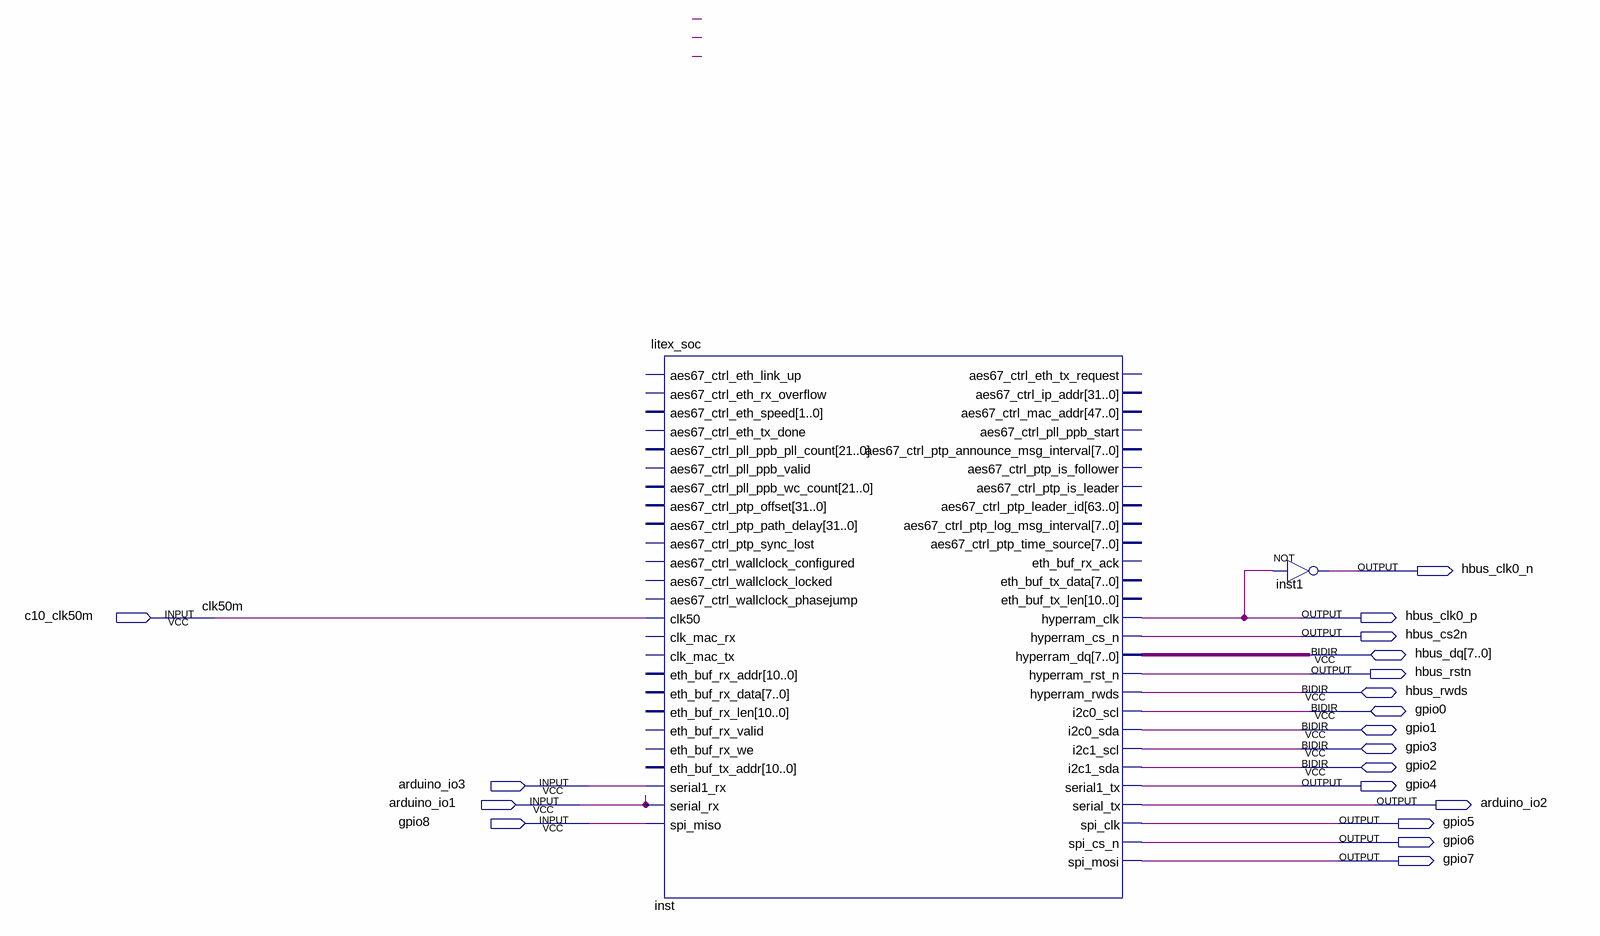
[diagram p0: schematic sheet]
// Quartus schematic soc_top.bdf as structural Verilog: 2 symbols, 19 pins
module soc_top (
  input  c10_clk50m,
  input  arduino_io3,
  input  arduino_io1,
  input  gpio8,
  inout  [7:0] hbus_dq,
  inout  hbus_rwds,
  inout  gpio0,
  inout  gpio1,
  inout  gpio3,
  inout  gpio2,
  output hbus_clk0_n,
  output hbus_clk0_p,
  output hbus_cs2n,
  output hbus_rstn,
  output gpio4,
  output arduino_io2,
  output gpio5,
  output gpio6,
  output gpio7
);

  litex_soc inst (
    .clk50(c10_clk50m), .serial1_rx(arduino_io3), .serial_rx(arduino_io1), .spi_miso(gpio8),
    .hyperram_clk(hbus_clk0_p), .hyperram_cs_n(hbus_cs2n), .hyperram_rst_n(hbus_rstn), .serial1_tx(gpio4),
    .serial_tx(arduino_io2), .spi_clk(gpio5), .spi_cs_n(gpio6), .spi_mosi(gpio7), .hyperram_dq(hbus_dq),
    .hyperram_rwds(hbus_rwds), .i2c0_scl(gpio0), .i2c0_sda(gpio1), .i2c1_scl(gpio3), .i2c1_sda(gpio2));  // open: aes67_ctrl_eth_link_up, aes67_ctrl_eth_rx_overflow, aes67_ctrl_eth_speed, aes67_ctrl_eth_tx_done, aes67_ctrl_pll_ppb_pll_count, aes67_ctrl_pll_ppb_valid, aes67_ctrl_pll_ppb_wc_count, aes67_ctrl_ptp_offset, aes67_ctrl_ptp_path_delay, aes67_ctrl_ptp_sync_lost, aes67_ctrl_wallclock_configured, aes67_ctrl_wallclock_locked, aes67_ctrl_wallclock_phasejump, clk_mac_rx, clk_mac_tx, eth_buf_rx_addr, eth_buf_rx_data, eth_buf_rx_len, eth_buf_rx_valid, eth_buf_rx_we, eth_buf_tx_addr, aes67_ctrl_eth_tx_request, aes67_ctrl_ip_addr, aes67_ctrl_mac_addr, aes67_ctrl_pll_ppb_start, aes67_ctrl_ptp_announce_msg_interval, aes67_ctrl_ptp_is_follower, aes67_ctrl_ptp_is_leader, aes67_ctrl_ptp_leader_id, aes67_ctrl_ptp_log_msg_interval, aes67_ctrl_ptp_time_source, eth_buf_rx_ack, eth_buf_tx_data, eth_buf_tx_len
  not inst1 (hbus_clk0_n, hbus_clk0_p);

  // Other names for the same wires on the sheet: clk50m = c10_clk50m
endmodule
